# Altium project Biometric Sensing Breakout Board.PrjPcb
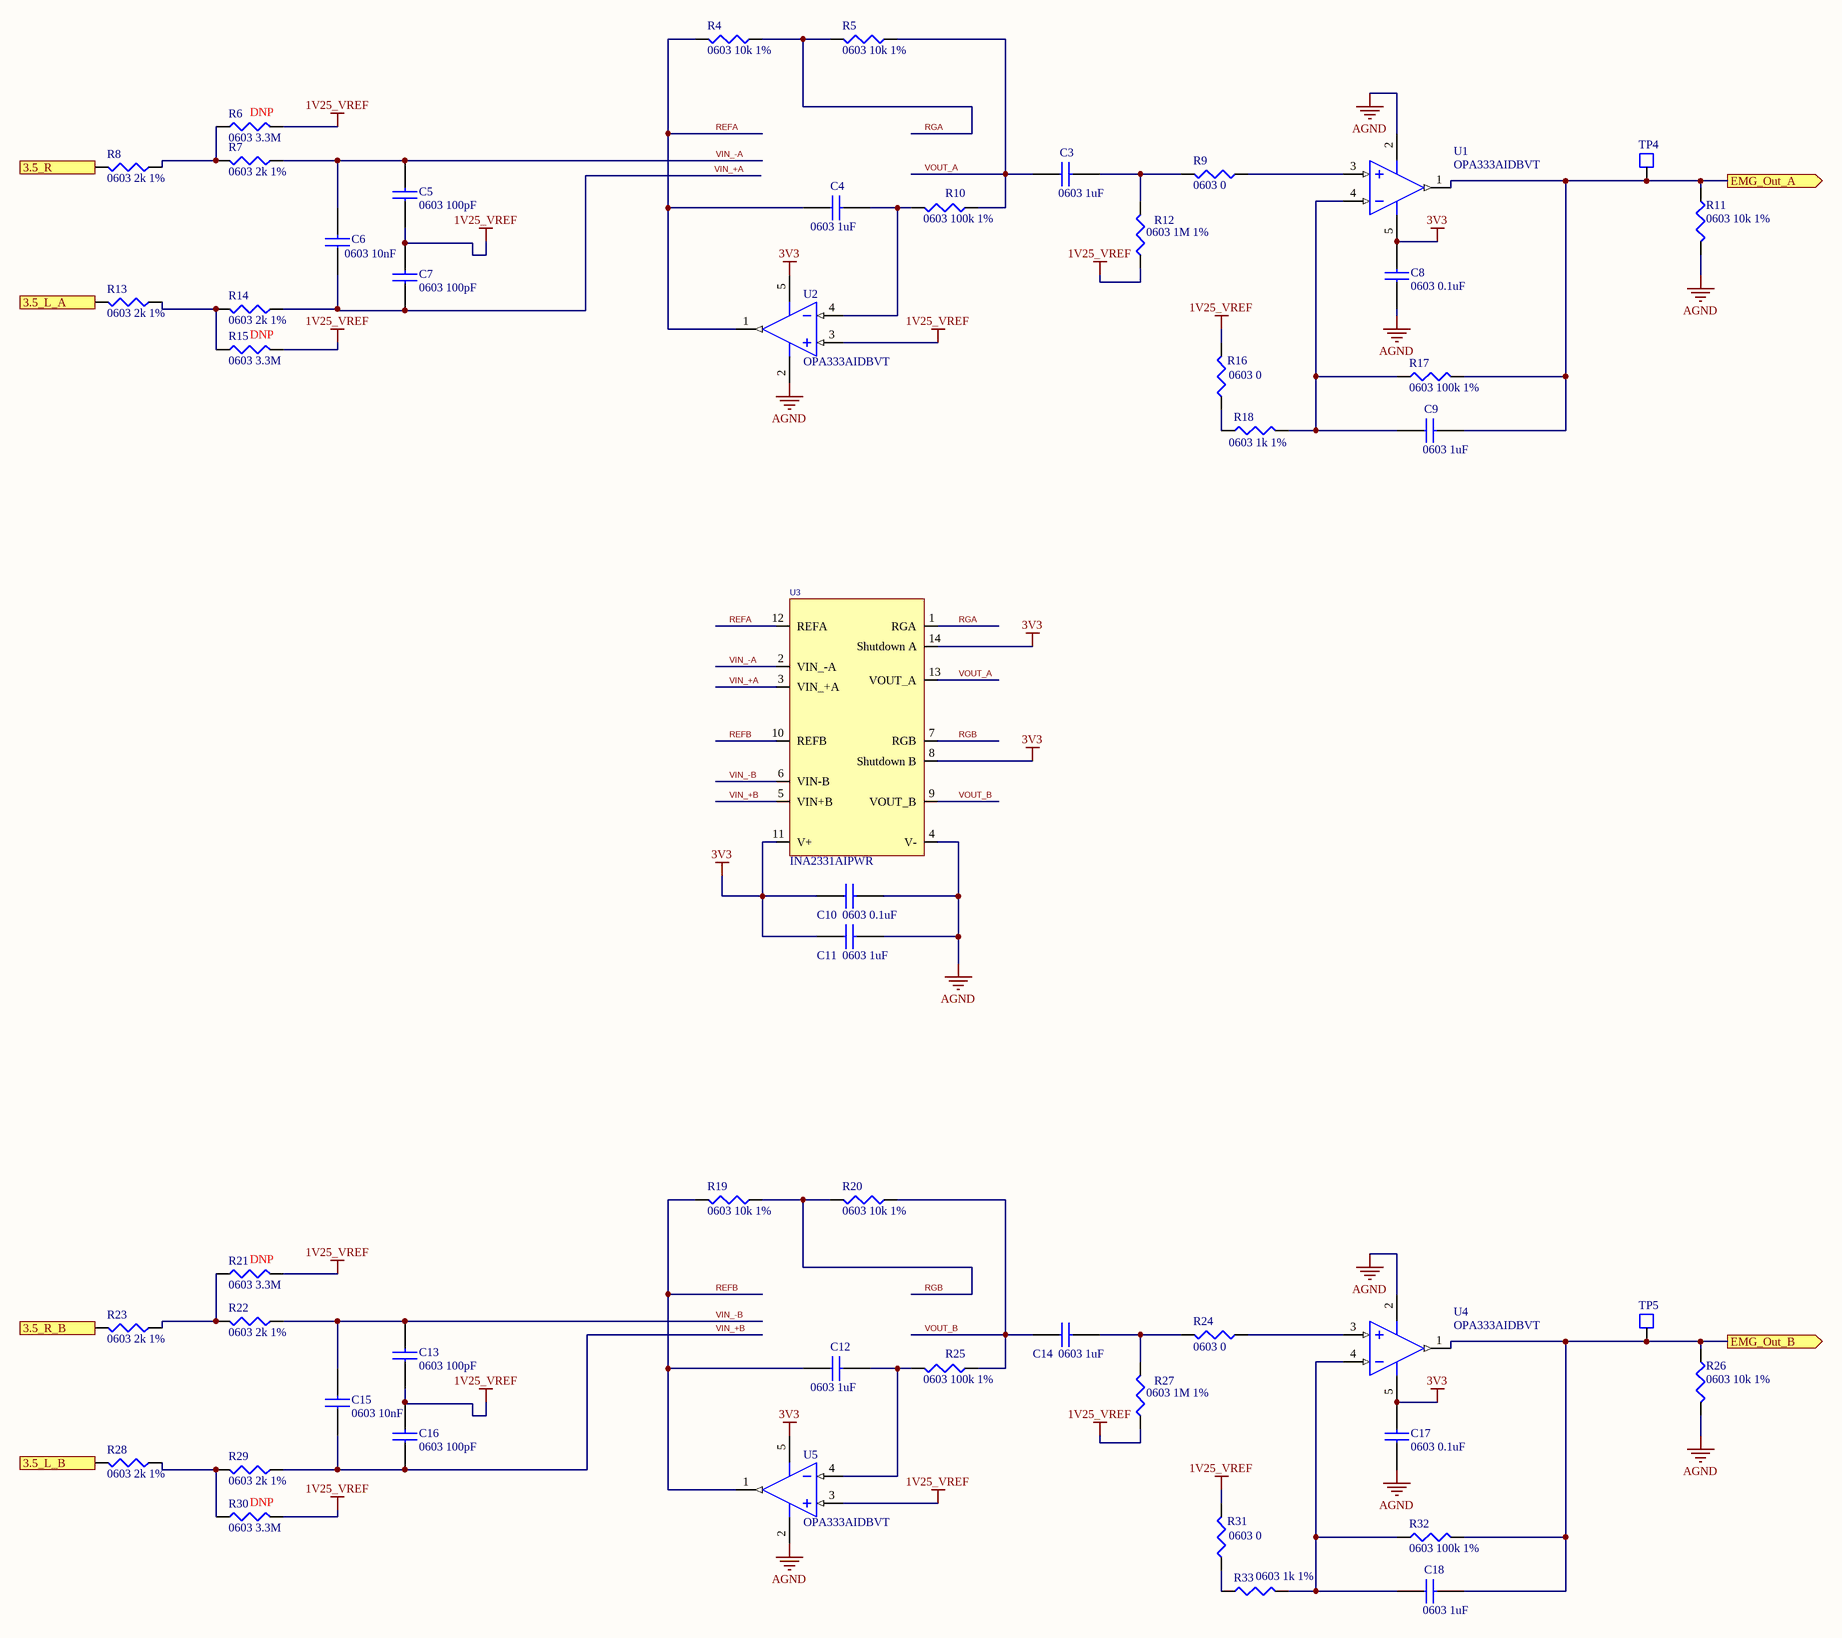
[diagram p0: EMG.SchDoc]
2 sheets, 67 parts. Net scope: flat (ports and power ports of the same name join across sheets).
Board file: BioSens.PcbDoc
Sheets:
  EMG.SchDoc
  Power.SchDoc

## Sheet EMG.SchDoc: EMG Sensor SET
size C; DrawnBy: Jun Zhang; Revision: A; SheetNumber: 2; SheetTotal: 4

### Parts
C3  0603 1uF  [CAP_0603_CER]
C4  0603 1uF  [CAP_0603_CER]
C5  0603 100pF  [CAP_0603_CER]
C6  0603 10nF  [CAP_0603_CER]
C7  0603 100pF  [CAP_0603_CER]
C8  0603 0.1uF  [CAP_0603_CER]
C9  0603 1uF  [CAP_0603_CER]
C10  0603 0.1uF  [CAP_0603_CER]
C11  0603 1uF  [CAP_0603_CER]
C12  0603 1uF  [CAP_0603_CER]
C13  0603 100pF  [CAP_0603_CER]
C14  0603 1uF  [CAP_0603_CER]
C15  0603 10nF  [CAP_0603_CER]
C16  0603 100pF  [CAP_0603_CER]
C17  0603 0.1uF  [CAP_0603_CER]
C18  0603 1uF  [CAP_0603_CER]
R4  0603 10k 1%  [0603]
R5  0603 10k 1%  [0603]
R6  0603 3.3M  [0603]  (no BOM)
R7  0603 2k 1%  [0603]
R8  0603 2k 1%  [0603]
R9  0603 0  [0603]
R10  0603 100k 1%  [0603]
R11  0603 10k 1%  [0603]
R12  0603 1M 1%  [0603]
R13  0603 2k 1%  [0603]
R14  0603 2k 1%  [0603]
R15  0603 3.3M  [0603]  (no BOM)
R16  0603 0  [0603]
R17  0603 100k 1%  [0603]
R18  0603 1k 1%  [0603]
R19  0603 10k 1%  [0603]
R20  0603 10k 1%  [0603]
R21  0603 3.3M  [0603]  (no BOM)
R22  0603 2k 1%  [0603]
R23  0603 2k 1%  [0603]
R24  0603 0  [0603]
R25  0603 100k 1%  [0603]
R26  0603 10k 1%  [0603]
R27  0603 1M 1%  [0603]
R28  0603 2k 1%  [0603]
R29  0603 2k 1%  [0603]
R30  0603 3.3M  [0603]  (no BOM)
R31  0603 0  [0603]
R32  0603 100k 1%  [0603]
R33  0603 1k 1%  [0603]
TP4  0402_TEST_PT  [0402_PAD]  (value not drawn)
TP5  0402_TEST_PT  [0402_PAD]  (value not drawn)
U1  OPA333AIDBVT  [DBV0005A_M]
U2  OPA333AIDBVT  [DBV0005A_M]
U3  INA2331AIPWR  [TSOP65P640X120-14N]
U4  OPA333AIDBVT  [DBV0005A_M]
U5  OPA333AIDBVT  [DBV0005A_M]

### Ports
3.5_L_A (in), 3.5_L_B (in), 3.5_R (in), 3.5_R_B (in), EMG_Out_A (out), EMG_Out_B (out)

### Nets
1V25_VREF: C5.1 C7.2 C13.1 C16.2 R6.2 R12.1 R15.2 R16.2 R21.2 R27.1 R30.2 R31.2 U2.3(+IN) U5.3(+IN)
3V3: C8.2 C10.1 C11.1 C17.2 U1.5(V+) U2.5(V+) U3.8(Shutdown_B) U3.11(V+) U3.14(Shutdown_A) U4.5(V+) U5.5(V+)
AGND: C8.1 C10.2 C11.2 C17.1 R11.2 R26.2 U1.2(V-) U2.2(V-) U3.4(V-) U4.2(V-) U5.2(V-)
REFA: C4.1 R4.2 U2.1(OUT) U3.12(REFA)
REFB: C12.1 R19.2 U3.10(REFB) U5.1(OUT)
RGA: R4.1 R5.2 U3.1(RGA)
RGB: R19.1 R20.2 U3.7(RGB)
VIN_+A: C6.1 C7.1 R14.1 U3.3(VIN_+A)
VIN_+B: C15.1 C16.1 R29.1 U3.5(VIN+B)
VIN_-A: C5.2 C6.2 R7.1 U3.2(VIN_-A)
VIN_-B: C13.2 C15.2 R22.1 U3.6(VIN-B)
VOUT_A: C3.1 R5.1 R10.1 U3.13(VOUT_A)
VOUT_B: C14.1 R20.1 R25.1 U3.9(VOUT_B)
NetC3_2: C3.2 R9.2 R12.2
NetC4_2: C4.2 R10.2 U2.4(-IN)
NetC9_1: C9.1 R17.1 R18.2 U1.4(-IN)
NetC9_2: C9.2 R11.1 R17.2 TP4.1 U1.1(OUT) ; port EMG_Out_A
NetC12_2: C12.2 R25.2 U5.4(-IN)
NetC14_2: C14.2 R24.2 R27.2
NetC18_1: C18.1 R32.1 R33.2 U4.4(-IN)
NetC18_2: C18.2 R26.1 R32.2 TP5.1 U4.1(OUT) ; port EMG_Out_B
NetR6_1: R6.1 R7.2 R8.1
NetR8_2: R8.2 ; port 3.5_R
NetR9_1: R9.1 U1.3(+IN)
NetR13_1: R13.1 R14.2 R15.1
NetR13_2: R13.2 ; port 3.5_L_A
NetR16_1: R16.1 R18.1
NetR21_1: R21.1 R22.2 R23.1
NetR23_2: R23.2 ; port 3.5_R_B
NetR24_1: R24.1 U4.3(+IN)
NetR28_1: R28.1 R29.2 R30.1
NetR28_2: R28.2 ; port 3.5_L_B
NetR31_1: R31.1 R33.1

### Notes on the sheet
- (near R6) DNP
- (near R15) DNP
- (near R21) DNP
- (near R30) DNP

### Library data of the parts
C3 C4 C11 C12 C14 = CAP_NP: Generic Cap for NC (No Polar) / ESR <30mOhm / ESL <1.5nH, / X5R; Manufacturer: KEMET; Manufacturer Part Number: C0603C105K8RAC7867; Dielectric: X7R; ComponentLink1Description: New link; ComponentLink1URL: *; Capacitance: 1uF; Package: 0603
C5 C7 C13 C16 = CAP_NP: Generic Cap for NC (No Polar) / ESR <30mOhm / ESL <1.5nH, / C0G; Manufacturer: KEMET; Manufacturer Part Number: C0603C101J3GAC7867; ComponentLink1Description: New link; ComponentLink1URL: *; Capacitance: 100pF; Package: 0603; Dielectric: C0G
C6 C15 = CAP_NP: Generic Cap for NC (No Polar) / ESR <30mOhm / ESL <1.5nH, / X7R; Manufacturer: KEMET; Manufacturer Part Number: C0603C103K4REC7867; ComponentLink1Description: New link; ComponentLink1URL: *; Capacitance: 10nF; Package: 0603; Dielectric: X7R
C8 C10 C17 = CAP_NP: Generic Cap for NC (No Polar) / ESR <30mOhm / ESL <1.5nH, / X7R; Manufacturer: KEMET; Manufacturer Part Number: C0603C104K5RAC7867; ComponentLink1Description: New link; ComponentLink1URL: *; Capacitance: 0.1uF; Package: 0603; Dielectric: X7R
C9 C18 = CAP_NP: Generic Cap for NC (No Polar) / ESR <30mOhm / ESL <1.5nH, / X7R; Manufacturer: KEMET; Manufacturer Part Number: C0603C105K8RAC7867; ComponentLink1Description: New link; ComponentLink1URL: *; Capacitance: 1uF; Package: 0603; Dielectric: X7R
R4 R5 R7 R8 R11 R13 R14 R19 R20 R22 R23 R26 R28 R29 = RESISTOR: Generic Resistor; Manufacturer: YAGEO; Manufacturer Part Number: *; Package: 0603
  R4 R5 R11 R19 R20 R26: Resistance: 10k
  R7 R8 R13 R14 R22 R23 R28 R29: Resistance: 2k
R6 R12 R15 R21 R27 R30 = RESISTOR: Generic Resistor; Manufacturer Part Number: *; Manufacturer: *; Package: 0603
  R6 R15: Resistance: *
  R12 R27: Resistance: 1M
  R21 R30: Resistance: 3.3M
R9 R16 R24 R31 = RESISTOR: Generic Resistor; Manufacturer: YAGEO; Resistance: 0; Manufacturer Part Number: *; Package: 0603
R10 R17 R18 R25 R32 R33 = RESISTOR: Generic Resistor; Manufacturer: Vishay Dale; Manufacturer Part Number: *; Package: 0603
  R10 R17 R25 R32: Resistance: 100k
  R18 R33: Resistance: 1k
U1 U2 U4 U5 = CMP-014-00019-2: MicroPower, Zero Drift CMOS Operational Amplifier, 1.8 to 5.5 V, 17 uA, -40 to 125 degC, 5-Pin SOT23 (DBV5), Green (RoHS & no Sb/Br), Tape and Reel; Manufacturer: Texas Instruments (TI); Min Supply Voltage: 900mV; Unity Gain Bandwidth Product: 350KHz; Slew Rate: 0.16V/us; Max Dual Supply Voltage: 2.75V; Nominal Voltage Gain: 130dB; Channels: 1; Common Mode Rejection Ratio: 106dB; Output Current: 5mA; Nominal Supply Current: 25uA; Max I/O Voltage: 10uV; Datasheet URL: http://www.ti.com/general/docs/lit/getliterature.tsp?genericPartNumber=OPA333&fileType=pdf; Manufacturer URL: http://www.ti.com/; Min Dual Supply Voltage: 900mV; Case/Package: SOT-23-5; Packaging: TapeandReel; RoHS Compliant: True; Package URL: http://www.ti.com/lit/ml/mpds018l/mpds018l.pdf; Package Quantity: 250; Mounting Technology: SM; Package Reference: DBV0005A; Nominal Gain Bandwith Product: 350KHz; Max Operating Temperature: 125°C; Pins: 5; Max Supply Voltage: 2.75V; Package Description: 5-Pin Small Outline Transistor, Body 2.9 x 1.6 mm, Pitch 0.95 mm; Datasheet Version: SBOS351E, 12/2015; Min Operating Temperature: -40°C
U3 = INA2331AIPWR: Low-power, single-supply, CMOS, instrumentation amplifier 14-TSSOP -55 to 125; Manufacturer: Texas Instruments; Slew Rate: 5V/µs; -3db Bandwidth: 2MHz; Nominal Supply Current: 980uA; Common Mode Rejection Ratio: 80dB; Number of Channels: 2; Max Supply Voltage: 5.5V; Min Supply Voltage: 2.7V; Input Bias Current: 10pA; Input Offset Voltage (Vos): 1mV; Operating Supply Current: 415uA; Output Current per Channel: 48mA; Power Supply Rejection Ratio (PSRR): 86.02dB; Number of Elements: 6; Voltage Gain: 60dB; Input Resistance: 10000GR; Supplier 1: Digi-Key; Supplier Part Number 1: 296-44980-1-ND; Manufacturer Part Number: INA2331AIPWR; RoHS: Yes; Category: Amplifiers - Op Amps, Buffer, Instrumentation; Stock 1: 163; Pricing 1: 1=3.12000, 10=2.79800, 25=2.64480, 100=2.29230, 250=2.17476, 500=1.95140, 1000=1.94075 (USD); Case/Package: TSSOP; Number of Pins: 14; Contact Plating: Gold; Min Operating Temperature: -55°C; Max Operating Temperature: 125°C; Package Quantity: 1; Packaging: Tape and Reel; Number of Circuits: 2; Quiescent Current: 415uA; Bandwidth: 2MHz; Series: -; Supply Current: 980uA; Gain Bandwidth Product: 2MHz; Radiation Hardening: No; Lead Free: Lead Free; RoHS Compliant: Yes; ComponentLink1URL: https://datasheet.ciiva.com/1814/ina2331-1814816.pdf?src-supplier=Digi-Key; ComponentLink1Description: https://datasheet.ciiva.com/1814/ina2331-1814816.pdf?src-supplier=Digi-Key; ComponentLink2URL: https://datasheet.ciiva.com/15128/getdatasheetpartid-248786-15128608.pdf?src-supplier=Verical; ComponentLink2Description: https://datasheet.ciiva.com/15128/getdatasheetpartid-248786-15128608.pdf?src-supplier=Verical; ComponentLink3URL: https://datasheet.ciiva.com/26852/ina2331aipwr-26852132.pdf?src-supplier=IIIC; ComponentLink3Description: https://datasheet.ciiva.com/26852/ina2331aipwr-26852132.pdf?src-supplier=IIIC; ComponentLink4URL: https://datasheet.ciiva.com/1814/ina2331-1814814.pdf?src-supplier=Digi-Key; ComponentLink4Description: https://datasheet.ciiva.com/1814/ina2331-1814814.pdf?src-supplier=Digi-Key; ComponentLink5URL: https://datasheet.ciiva.com/1814/ina2331-1814815.pdf?src-supplier=Digi-Key; ComponentLink5Description: https://datasheet.ciiva.com/1814/ina2331-1814815.pdf?src-supplier=Digi-Key; ComponentLink6URL: https://datasheet.ciiva.com/2978/ina331-2978080.pdf?src-supplier=Avnet; ComponentLink6Description: https://datasheet.ciiva.com/2978/ina331-2978080.pdf?src-supplier=Avnet

## Sheet Power.SchDoc: Power
size A; DrawnBy: Jun Zhang; Revision: A; SheetNumber: 4; SheetTotal: 4
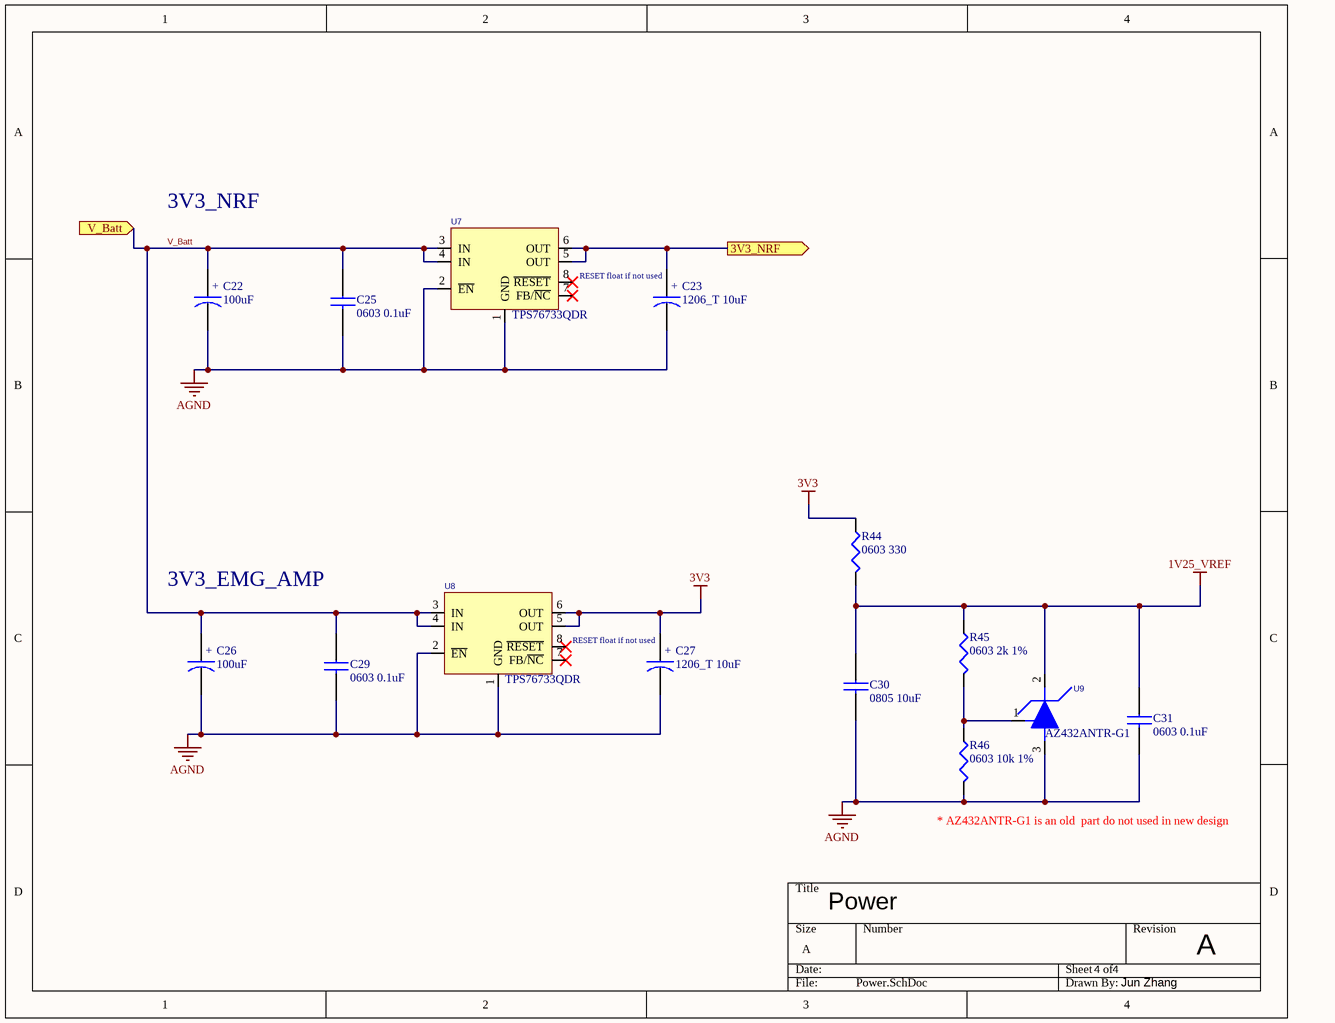
[diagram p1: Power.SchDoc]

### Parts
C22  100uF  [CAPAE7866X61M]
C23  1206_T 10uF  [CAP_1206_TANT]
C25  0603 0.1uF  [CAP_0603_CER]
C26  100uF  [CAPAE7866X61M]
C27  1206_T 10uF  [CAP_1206_TANT]
C29  0603 0.1uF  [CAP_0603_CER]
C30  0805 10uF  [CAP_0805_CER]
C31  0603 0.1uF  [CAP_0603_CER]
R44  0603 330  [0603]
R45  0603 2k 1%  [0603]
R46  0603 10k 1%  [0603]
U7  TPS76733QDR  [SOIC127P600X175-8N]
U8  TPS76733QDR  [SOIC127P600X175-8N]
U9  AZ432ANTR-G1  [SOT95P245X110-3N]

### Ports
3V3_NRF (out), V_Batt (in)

### Nets
1V25_VREF: C30.1 C31.1 R44.2 R45.1 U9.2(Cathode)
3V3: C27.1 R44.1 U8.5(OUT) U8.6(OUT)
AGND: C22.2 C23.2 C25.2 C26.2 C27.2 C29.2 C30.2 C31.2 R46.2 U7.1(GND) U7.2(~{EN}) U8.1(GND) U8.2(~{EN}) U9.3(Anode)
V_Batt: C22.1 C25.1 C26.1 C29.1 U7.3(IN) U7.4(IN) U8.3(IN) U8.4(IN) ; port V_Batt
NetC23_1: C23.1 U7.5(OUT) U7.6(OUT) ; port 3V3_NRF
NetR45_2: R45.2 R46.1 U9.1(REF)

Not connected (* = marked no-connect by the designer): U7 7(FB/~{NC})* 8(~{RESET})*; U8 7(FB/~{NC})* 8(~{RESET})*

### Notes on the sheet
- 3V3_NRF
- RESET float if not used
- 3V3_EMG_AMP
- (near R46) * AZ432ANTR-G1 is an old  part do not used in new design
- (in symbol CAP_POL) +

### Library data of the parts
C22 C26 = CAP_POL: Electrolytic 100uF; Manufacturer Part Number: AFK107M16D16T-F; Manufacturer: Cornell Dubilier Electronics (CDE); Capacitance: 100uF; Dielectric: *; Package: CAPAE; Supplier 1: Digi-Key; Supplier Part Number 1: 338-2140-1-ND
C23 C27 = CAP_POL: Tantalum CAP / ESR: 900mOhm / Rated: 10V; Manufacturer Part Number: TPSA106K010R0900; Manufacturer: KYOCERA AVX; Tolerance: +/- 10%; Capacitance: 10uF; Dielectric: *; Package: 1206; Supplier 1: Digi-Key; Supplier Part Number 1: 478-1751-1-ND; ESR: 900m Ohm
C25 C29 = CAP_NP: Generic Cap for NC (No Polar) / ESR <30mOhm / ESL <1.5nH, / X7R; Manufacturer: KYOCERA AVX; Manufacturer Part Number: 06033C104K4T4A; ComponentLink1Description: New link; ComponentLink1URL: *; Capacitance: 0.1uF; Package: 0603; Dielectric: X7R; Supplier 1: Digi-Key; Supplier Part Number 1: 478-10673-1-ND
C30 = CAP_NP: Generic Cap for NC (No Polar) / ESR <30mOhm / ESL <1.5nH, / X7R; Manufacturer: KEMET; Manufacturer Part Number: C0805C106M8RACTU; ComponentLink1Description: New link; ComponentLink1URL: *; Capacitance: 10uF; Package: 0603; Dielectric: X7R
C31 = CAP_NP: as C8 on sheet EMG; ComponentLink1Description: New link; ComponentLink1URL: *; Capacitance: 0.1uF; Package: 0603; Dielectric: X7R
R44 = RESISTOR: Generic Resistor; Resistance: 330; Manufacturer Part Number: *; Manufacturer: *; Package: 0603
R45 R46 = RESISTOR: Generic Resistor; Manufacturer: YAGEO; Manufacturer Part Number: *; Package: 0603
  R45: Resistance: 2k
  R46: Resistance: 10k
U7 U8 = TPS76733QDR: IC REG LDO 3.3V 1A 8SOIC / LDO Regulator Pos 3.3V 1A 8-Pin SOIC T/R; Manufacturer: Texas Instruments; Number of Outputs: 1; Max Power Dissipation: 904mW; Dropout Voltage: 350mV; Max Input Voltage: 10V; Min Input Voltage: 2.7V; Input Bias Current: 85uA; Min Current Limit: 1.2A; Polarity: Positive; Quiescent Current: 80uA; Output Voltage Accuracy: 2%; Output Type: Fixed; Supplier 1: Arrow Electronics; Supplier Part Number 1: TPS76733QDR; Manufacturer Part Number: TPS76733QDR; RoHS: Yes; Category: Voltage Regulators - Linear; Case/Package: D; Number of Pins: 8; Min Operating Temperature: -40°C; Max Operating Temperature: 125°C; Package Quantity: 2500; Output Current: 1A; Output Voltage: 3.3V; Packaging: Tape and Reel; Max Output Current: 1A; Number of Regulators: 1; Power Dissipation: 904mW; Accuracy: 2%; Max Output Voltage: 3.3V; Min Output Voltage: 3.3V; Series: -; Lead Free: Lead Free; RoHS Compliant: Yes; ComponentLink1URL: https://datasheet.ciiva.com/26909/tps76733qdr-26909024.pdf?src-supplier=IIIC; ComponentLink1Description: https://datasheet.ciiva.com/26909/tps76733qdr-26909024.pdf?src-supplier=IIIC; ComponentLink2URL: https://datasheet.ciiva.com/2064/tps76701-2064275.pdf?src-supplier=Digi-Key; ComponentLink2Description: https://datasheet.ciiva.com/2064/tps76701-2064275.pdf?src-supplier=Digi-Key; ComponentLink3URL: https://datasheet.ciiva.com/14275/tps76701-14275656.pdf?src-supplier=Avnet; ComponentLink3Description: https://datasheet.ciiva.com/14275/tps76701-14275656.pdf?src-supplier=Avnet
U9 = AZ432ANTR-G1: V-Ref Adjustable/Precision/Programmable 1.25V to 18V 100mA 3-Pin SOT-23 T/R; Manufacturer: Diodes; Temperature Coefficient: 20ppm/°C; Cathode Current: 80uA; Tolerance: 0.5%; Reference Type: Shunt; Supplier 1: Digi-Key; Supplier Part Number 1: AZ432ANTR-G1DICT-ND; Manufacturer Part Number: AZ432ANTR-G1; RoHS: Yes; Category: Voltage References; Stock 1: 92; Pricing 1: 1=0.49000, 10=0.37200, 25=0.33600, 100=0.23200, 250=0.19536, 500=0.15874, 1000=0.12211 (USD); Mount: Surface Mount; Case/Package: TO-236-3; Min Operating Temperature: -40°C; Max Operating Temperature: 125°C; Max Input Voltage: 18V; Max Output Current: 100mA; Packaging: Tape and Reel; Output Voltage: 18V; Min Output Voltage: 1.25V; Max Output Voltage: 18V; Output Current: 100mA; Output Type: Adjustable; Radiation Hardening: No; RoHS Compliant: Yes; ComponentLink1URL: http://www.diodes.com/datasheets/AZ432.pdf?src-supplier=Avnet; ComponentLink1Description: http://www.diodes.com/datasheets/AZ432.pdf?src-supplier=Avnet; ComponentLink2URL: https://www.diodes.com/assets/Datasheets/AZ432.pdf?src-supplier=Digi-Key; ComponentLink2Description: https://www.diodes.com/assets/Datasheets/AZ432.pdf?src-supplier=Digi-Key

## Nets that join several sheets
1V25_VREF: EMG (14 pins), Power (5 pins)
3V3: EMG (11 pins), Power (C27.1 R44.1 U8.5 U8.6)
AGND: EMG (11 pins), Power (14 pins)

## Assembly variants
Resistor (NP): not fitted R6 R15 R21 R30 R35